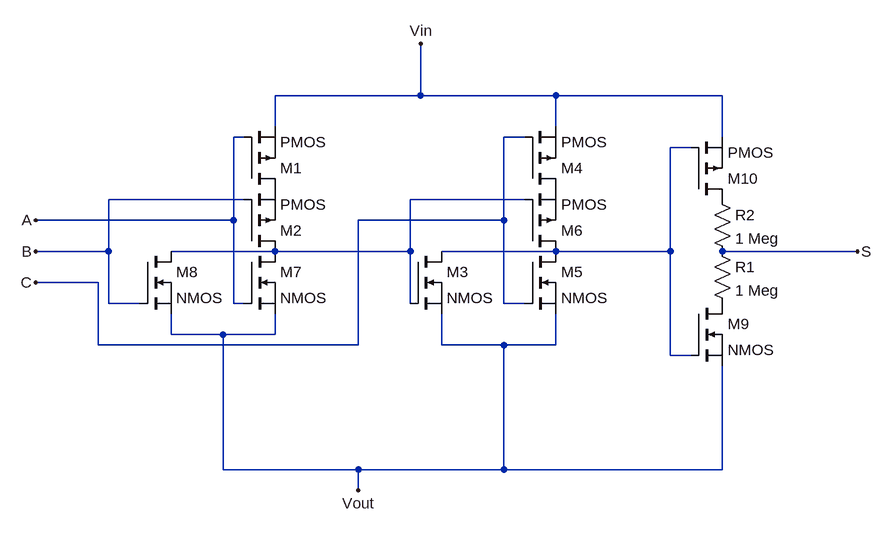
[diagram p0: schematic OR3.asc]
OR3.asc, the LTspice schematic file:
Version 4
SHEET 1 1124 776
WIRE 416 16 416 -64
WIRE 416 16 192 16
WIRE 624 16 416 16
WIRE 880 16 624 16
WIRE 192 64 192 16
WIRE 624 64 624 16
WIRE 144 80 128 80
WIRE 576 80 544 80
WIRE 880 80 880 16
WIRE 832 96 800 96
WIRE 144 176 -64 176
WIRE 576 176 400 176
WIRE 128 208 128 80
WIRE 128 208 -176 208
WIRE 544 208 544 80
WIRE 544 208 320 208
WIRE -64 256 -64 176
WIRE -64 256 -176 256
WIRE 192 256 32 256
WIRE 400 256 400 176
WIRE 400 256 192 256
WIRE 624 256 448 256
WIRE 800 256 800 96
WIRE 800 256 624 256
WIRE 1088 256 880 256
WIRE -80 304 -176 304
WIRE -64 336 -64 256
WIRE -16 336 -64 336
WIRE 128 336 128 208
WIRE 144 336 128 336
WIRE 400 336 400 256
WIRE 544 336 544 208
WIRE 576 336 544 336
WIRE 32 384 32 352
WIRE 112 384 32 384
WIRE 192 384 192 352
WIRE 192 384 112 384
WIRE -80 400 -80 304
WIRE 320 400 320 208
WIRE 320 400 -80 400
WIRE 448 400 448 352
WIRE 544 400 448 400
WIRE 624 400 624 352
WIRE 624 400 544 400
WIRE 800 416 800 256
WIRE 832 416 800 416
WIRE 112 592 112 384
WIRE 320 592 112 592
WIRE 544 592 544 400
WIRE 544 592 320 592
WIRE 880 592 880 432
WIRE 880 592 544 592
WIRE 320 624 320 592
FLAG -176 208 A
FLAG -176 256 B
FLAG -176 304 C
FLAG 416 -64 Vin
FLAG 1088 256 S
FLAG 320 624 Vout
SYMBOL pmos 144 160 M180
SYMATTR InstName M1
SYMBOL pmos 144 256 M180
SYMATTR InstName M2
SYMBOL pmos 576 160 M180
SYMATTR InstName M4
SYMBOL pmos 576 256 M180
SYMATTR InstName M6
SYMBOL nmos 144 256 R0
SYMATTR InstName M7
SYMBOL nmos -16 256 R0
SYMATTR InstName M8
SYMBOL nmos 400 256 R0
SYMATTR InstName M3
SYMBOL nmos 576 256 R0
SYMATTR InstName M5
SYMBOL nmos 832 336 R0
SYMATTR InstName M9
SYMBOL res 864 240 R0
SYMATTR InstName R1
SYMATTR Value 1 Meg
SYMBOL res 864 160 R0
SYMATTR InstName R2
SYMATTR Value 1 Meg
SYMBOL pmos 832 176 M180
SYMATTR InstName M10

The netlist it stands for:
* OR3.asc
M1 P001 A Vin Vin PMOS
M2 N002 B P001 P001 PMOS
M4 P002 C Vin Vin PMOS
M6 N001 N002 P002 P002 PMOS
M7 N002 A Vout Vout NMOS
M8 N002 B Vout Vout NMOS
M3 N001 N002 Vout Vout NMOS
M5 N001 C Vout Vout NMOS
M9 P003 N001 Vout Vout NMOS
R1 S P003 1 Meg
R2 P004 S 1 Meg
M10 P004 N001 Vin Vin PMOS
.model NMOS NMOS
.model PMOS PMOS
.lib standard.mos
.backanno
.end